# EAGLE design satellites_pcb_th_v1 (EAGLE 7.6.0)
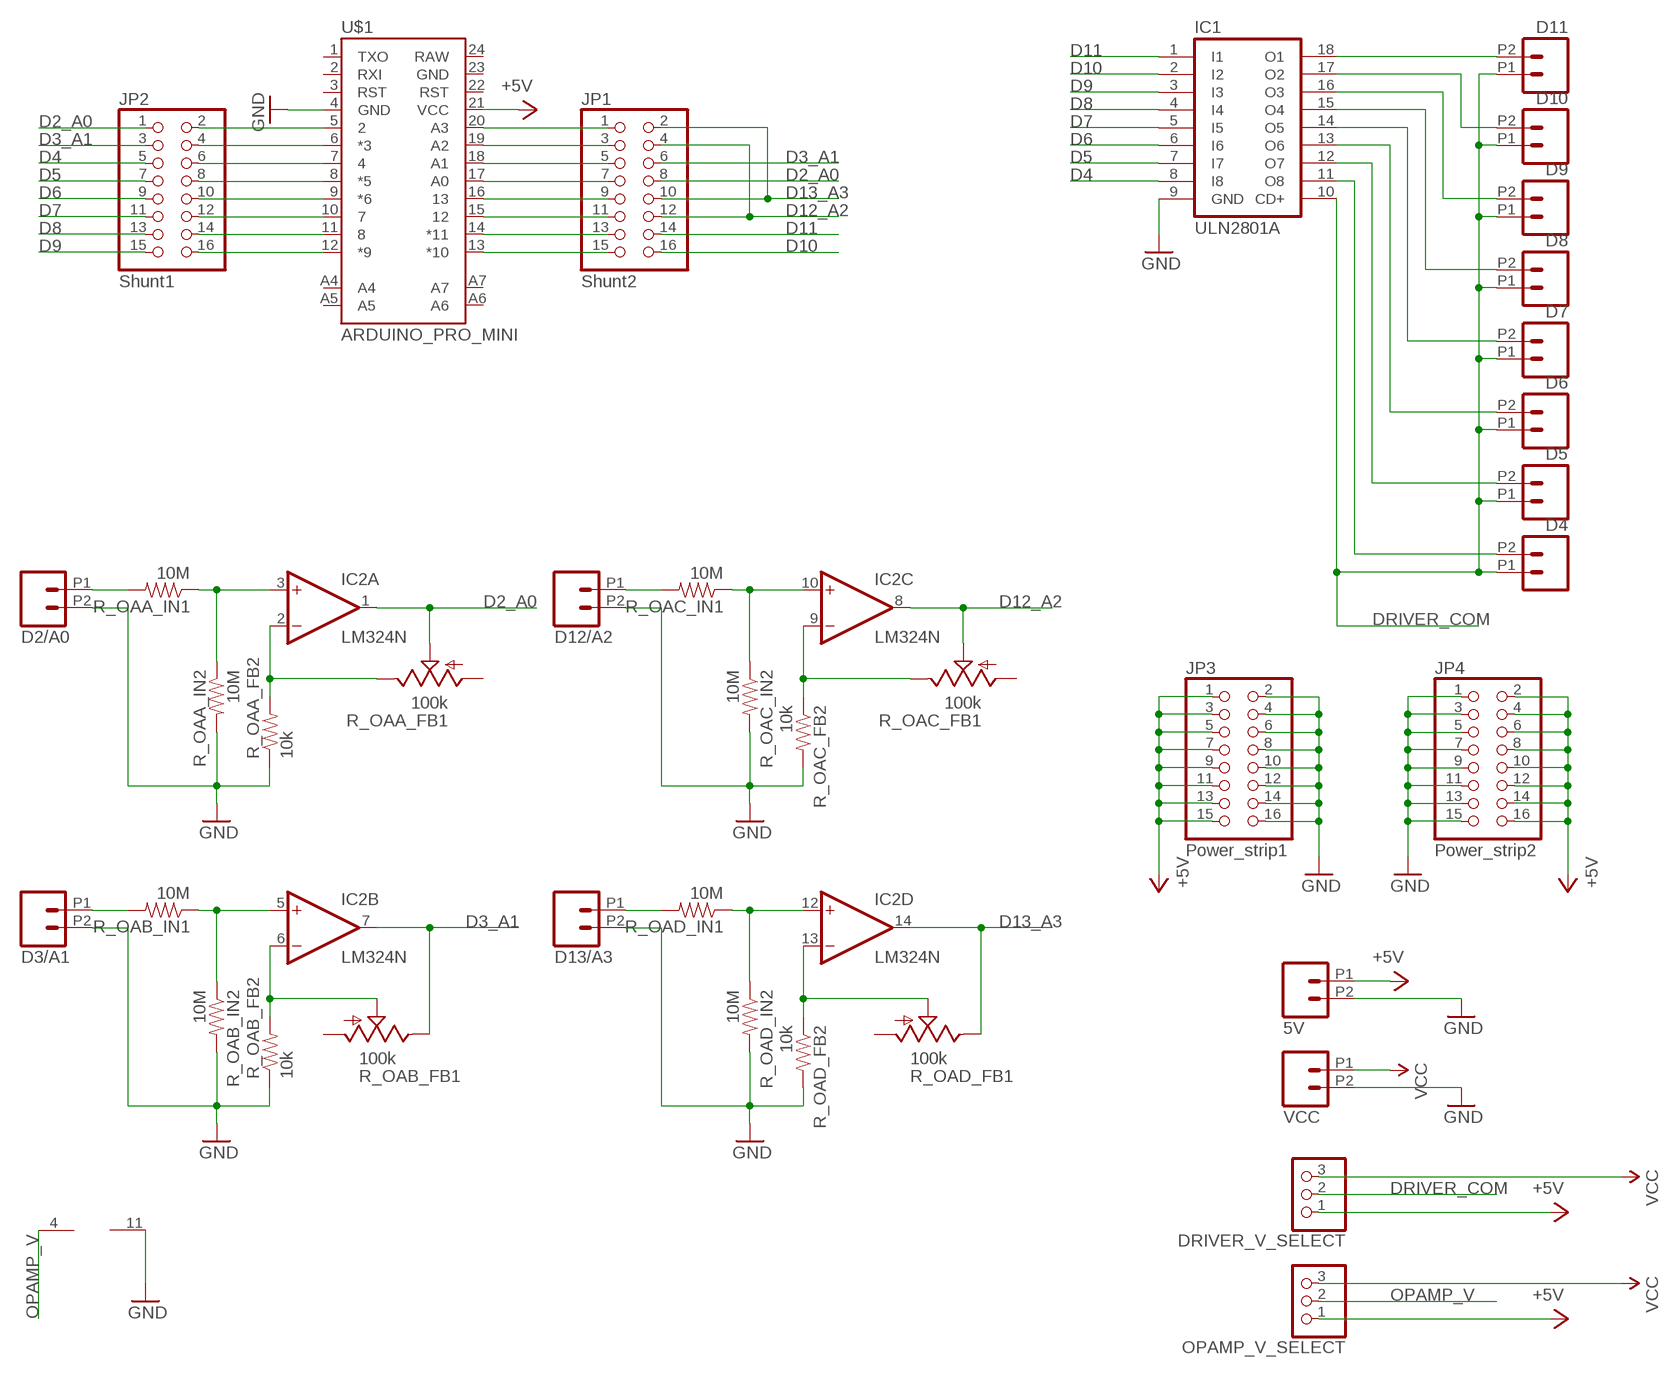
[diagram p0: schematic, sheet 1]

## Parts
5V  M022.54MM_SCREWTERM  [1X02_2.54_SCREWTERM]
D2/A0  M022.54MM_SCREWTERM  [1X02_2.54_SCREWTERM]
D3/A1  M022.54MM_SCREWTERM  [1X02_2.54_SCREWTERM]
D4  M022.54MM_SCREWTERM  [1X02_2.54_SCREWTERM]
D5  M022.54MM_SCREWTERM  [1X02_2.54_SCREWTERM]
D6  M022.54MM_SCREWTERM  [1X02_2.54_SCREWTERM]
D7  M022.54MM_SCREWTERM  [1X02_2.54_SCREWTERM]
D8  M022.54MM_SCREWTERM  [1X02_2.54_SCREWTERM]
D9  M022.54MM_SCREWTERM  [1X02_2.54_SCREWTERM]
D10  M022.54MM_SCREWTERM  [1X02_2.54_SCREWTERM]
D11  M022.54MM_SCREWTERM  [1X02_2.54_SCREWTERM]
D12/A2  M022.54MM_SCREWTERM  [1X02_2.54_SCREWTERM]
D13/A3  M022.54MM_SCREWTERM  [1X02_2.54_SCREWTERM]
DRIVER_V_SELECT  PINHD-1X3  [1X03]
IC1  ULN2801A  [DIL18]
IC2  LM324N  [DIL14]
JP1  Shunt2  PINHD-2X8  [2X08]
JP2  Shunt1  PINHD-2X8  [2X08]
JP3  Power_strip1  PINHD-2X8  [2X08]
JP4  Power_strip2  PINHD-2X8  [2X08]
OPAMP_V_SELECT  PINHD-1X3  [1X03]
R_OAA_FB1  100k  TRIM_US-B64W  [B64W]
R_OAA_FB2  10k  RESISTORAXIAL-0.3  [AXIAL-0.3]
R_OAA_IN1  10M  RESISTORAXIAL-0.3  [AXIAL-0.3]
R_OAA_IN2  10M  RESISTORAXIAL-0.3  [AXIAL-0.3]
R_OAB_FB1  100k  TRIM_US-B64W  [B64W]
R_OAB_FB2  10k  RESISTORAXIAL-0.3  [AXIAL-0.3]
R_OAB_IN1  10M  RESISTORAXIAL-0.3  [AXIAL-0.3]
R_OAB_IN2  10M  RESISTORAXIAL-0.3  [AXIAL-0.3]
R_OAC_FB1  100k  TRIM_US-B64W  [B64W]
R_OAC_FB2  10k  RESISTORAXIAL-0.3  [AXIAL-0.3]
R_OAC_IN1  10M  RESISTORAXIAL-0.3  [AXIAL-0.3]
R_OAC_IN2  10M  RESISTORAXIAL-0.3  [AXIAL-0.3]
R_OAD_FB1  100k  TRIM_US-B64W  [B64W]
R_OAD_FB2  10k  RESISTORAXIAL-0.3  [AXIAL-0.3]
R_OAD_IN1  10M  RESISTORAXIAL-0.3  [AXIAL-0.3]
R_OAD_IN2  10M  RESISTORAXIAL-0.3  [AXIAL-0.3]
U$1  ARDUINO_PRO_MINI  [ARDUINO_PRO_MINI]
VCC  M022.54MM_SCREWTERM  [1X02_2.54_SCREWTERM]

## Nets
+5V [supply]: 5V.P1 DRIVER_V_SELECT.1 JP3.1 JP3.3 JP3.5 JP3.7 JP3.9 JP3.11 JP3.13 JP3.15 JP4.2 JP4.4 JP4.6 JP4.8 JP4.10 JP4.12 JP4.14 JP4.16 OPAMP_V_SELECT.1 U$1.21(VCC)
D2_A0: IC2.1(A:OUT) JP1.8 JP2.1 R_OAA_FB1.S
D3_A1: IC2.7(B:OUT) JP1.6 JP2.3 R_OAB_FB1.E
D4: IC1.8(I8) JP2.5
D5: IC1.7(I7) JP2.7
D6: IC1.6(I6) JP2.9
D7: IC1.5(I5) JP2.11
D8: IC1.4(I4) JP2.13
D9: IC1.3(I3) JP2.15
D10: IC1.2(I2) JP1.16
D11: IC1.1(I1) JP1.14
D12_A2: IC2.8(C:OUT) JP1.4 JP1.12 R_OAC_FB1.S
D13_A3: IC2.14(D:OUT) JP1.2 JP1.10 R_OAD_FB1.E
DRIVER_COM [supply]: D4.P1 D5.P1 D6.P1 D7.P1 D8.P1 D9.P1 D10.P1 D11.P1 DRIVER_V_SELECT.2 IC1.10(CD+)
GND [supply]: 5V.P2 D2/A0.P2 D3/A1.P2 D12/A2.P2 D13/A3.P2 IC1.9(GND) IC2.11(P:V-) JP3.2 JP3.4 JP3.6 JP3.8 JP3.10 JP3.12 JP3.14 JP3.16 JP4.1 JP4.3 JP4.5 JP4.7 JP4.9 JP4.11 JP4.13 JP4.15 R_OAA_FB2.P$1 R_OAA_IN2.P$2 R_OAB_FB2.P$1 R_OAB_IN2.P$2 R_OAC_FB2.P$2 R_OAC_IN2.P$2 R_OAD_FB2.P$2 R_OAD_IN2.P$2 U$1.4(GND) VCC.P2
N$1: JP2.2 U$1.5
N$2: JP2.4 U$1.6(*3)
N$3: JP2.6 U$1.7
N$4: JP2.8 U$1.8(*5)
N$5: JP2.10 U$1.9(*6)
N$6: JP2.12 U$1.10
N$7: JP2.14 U$1.11
N$8: JP2.16 U$1.12(*9)
N$9: D3/A1.P1 R_OAB_IN1.P$2
N$10: JP1.1 U$1.20(A3)
N$11: JP1.3 U$1.19(A2)
N$12: JP1.5 U$1.18(A1)
N$13: IC2.3(A:+IN) R_OAA_IN1.P$1 R_OAA_IN2.P$1
N$14: D12/A2.P1 R_OAC_IN1.P$2
N$15: IC2.10(C:+IN) R_OAC_IN1.P$1 R_OAC_IN2.P$1
N$16: D13/A3.P1 R_OAD_IN1.P$2
N$17: JP1.7 U$1.17(A0)
N$18: JP1.9 U$1.16
N$19: JP1.11 U$1.15
N$20: JP1.13 U$1.14(*11)
N$21: JP1.15 U$1.13(*10)
N$22 [supply]: D4.P2 IC1.11(O8)
N$25 [supply]: D11.P2 IC1.18(O1)
N$26 [supply]: D10.P2 IC1.17(O2)
N$27 [supply]: D9.P2 IC1.16(O3)
N$28 [supply]: D8.P2 IC1.15(O4)
N$29 [supply]: D7.P2 IC1.14(O5)
N$30 [supply]: D6.P2 IC1.13(O6)
N$31 [supply]: D5.P2 IC1.12(O7)
N$36: IC2.2(A:-IN) R_OAA_FB1.E R_OAA_FB2.P$2
N$38: IC2.6(B:-IN) R_OAB_FB1.S R_OAB_FB2.P$2
N$40: IC2.9(C:-IN) R_OAC_FB1.E R_OAC_FB2.P$1
N$42: IC2.13(D:-IN) R_OAD_FB1.S R_OAD_FB2.P$1
N$44: D2/A0.P1 R_OAA_IN1.P$2
N$45: IC2.5(B:+IN) R_OAB_IN1.P$1 R_OAB_IN2.P$1
N$49: IC2.12(D:+IN) R_OAD_IN1.P$1 R_OAD_IN2.P$1
OPAMP_V [supply]: IC2.4(P:V+) OPAMP_V_SELECT.2
VCC [supply]: DRIVER_V_SELECT.3 OPAMP_V_SELECT.3 VCC.P1
Unconnected: R_OAA_FB1.A R_OAB_FB1.A R_OAC_FB1.A R_OAD_FB1.A U$1.1(TXO) U$1.2(RXI) U$1.3(RST) U$1.22(RST) U$1.23(GND) U$1.24(RAW) U$1.A4 U$1.A5 U$1.A6 U$1.A7

## Library data of the parts
5V D2/A0 D3/A1 D4-D11 D12/A2 D13/A3 VCC = SparkFun-Connectors:M02: Standard 2-pin 0.1" header. Use with - straight break away headers ( PRT-00116) - right angle break away headers (PRT-00553) - swiss pins (PRT-00743) - machine pins (PRT-00117) - female headers (PRT-00115) Molex polarized connector foot print use with: PRT-08233 with associated crimp pins and housings. 2.54_SCREWTERM for use with PRT-10571. 3.5mm Screw Terminal footprints for PRT-08084 5mm Screw Terminal footprints for use with PRT-08432
DRIVER_V_SELECT OPAMP_V_SELECT = pinhead:PINHD-1X3: PIN HEADER
IC1 = uln-udn:ULN2801A: DRIVER ARRAY
IC2 = linear:LM324: OP AMP
JP1-JP4 = pinhead:PINHD-2X8: PIN HEADER
R_OAA_FB1 R_OAB_FB1 R_OAC_FB1 R_OAD_FB1 = pot:TRIM_US-: POTENTIOMETER
R_OAA_FB2 R_OAA_IN1 R_OAA_IN2 R_OAB_FB2 R_OAB_IN1 R_OAB_IN2 R_OAC_FB2 R_OAC_IN1 R_OAC_IN2 R_OAD_FB2 R_OAD_IN1 R_OAD_IN2 = SparkFun-Resistors:RESISTOR: Resistor Basic schematic elements and footprints for 0603, 1206, and PTH resistors.
U$1 = SparkFun-Boards:ARDUINO_PRO_MINI

## Net classes
0 default: width 0.254 mm, clearance 0.254 mm
1 supply: width 0.508 mm, clearance 0.508 mm

## Board
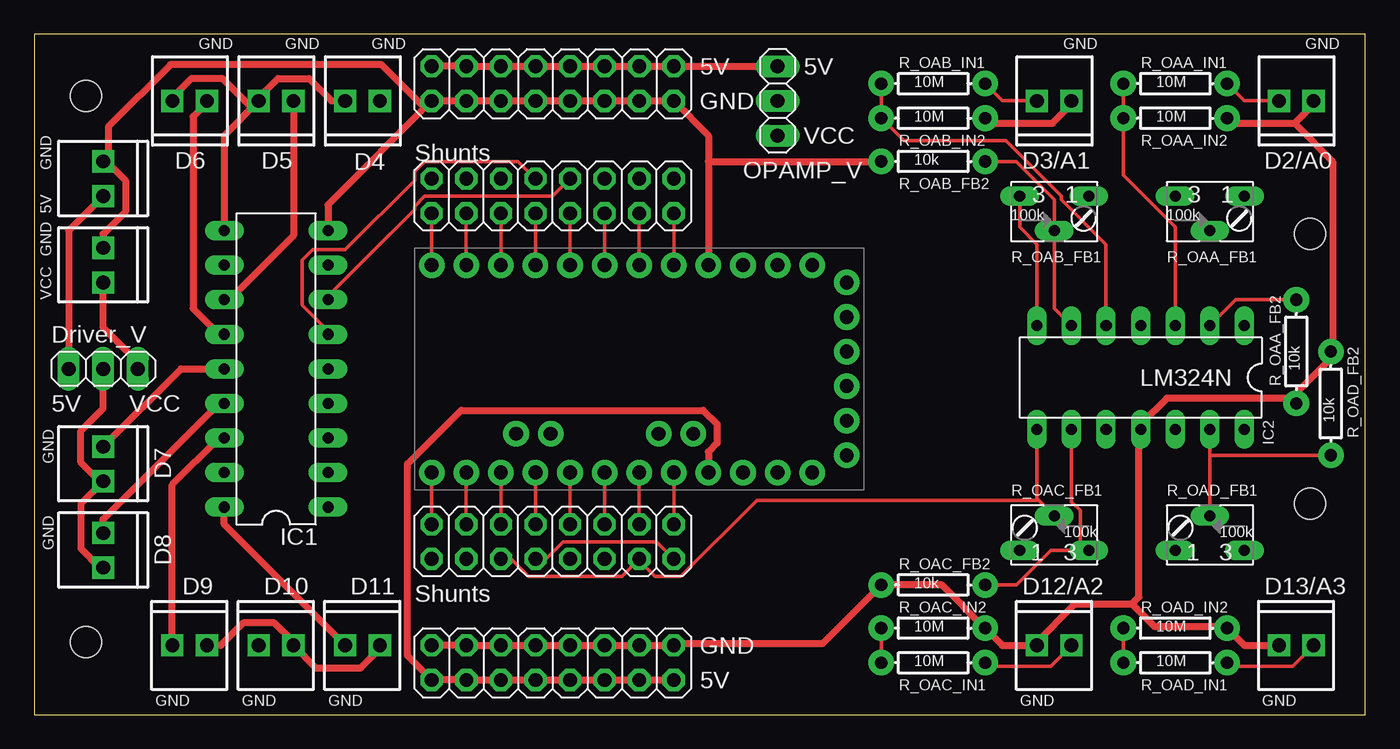
[diagram p1: board, top side]
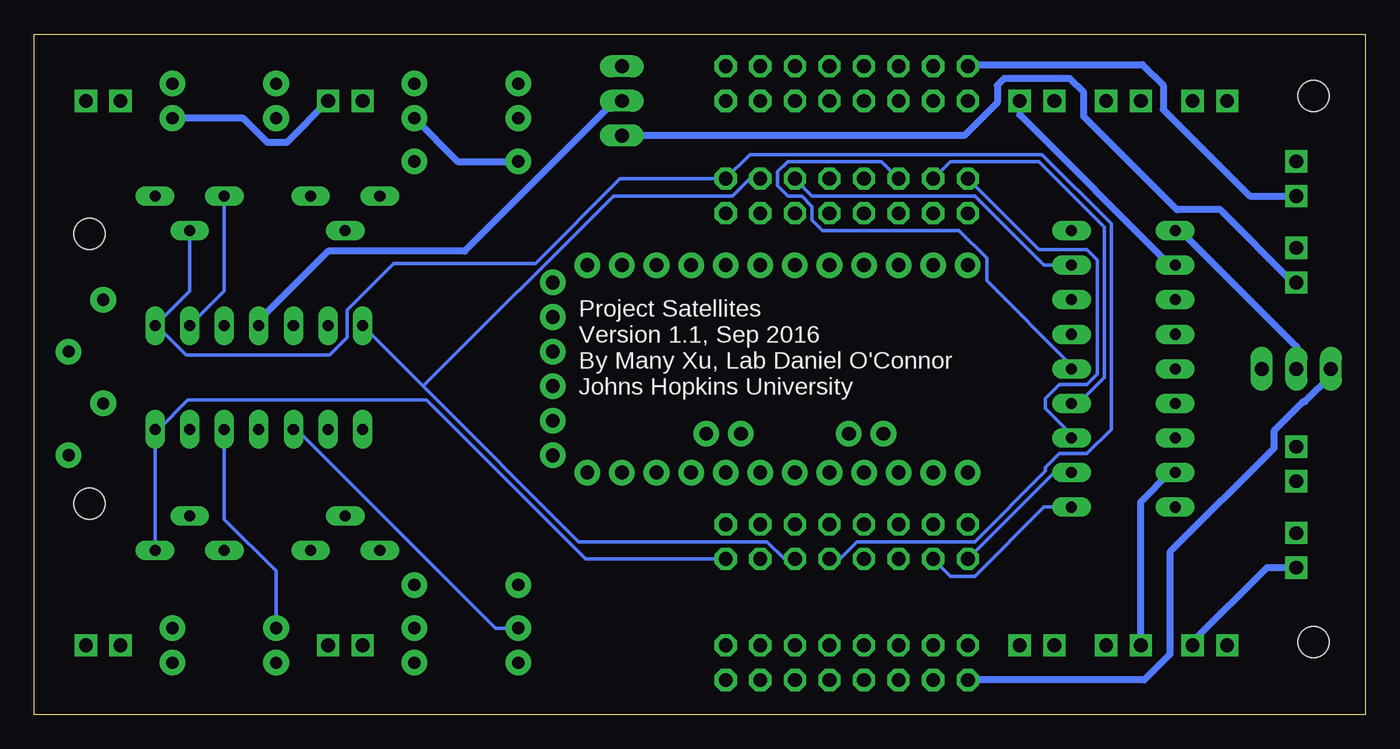
[diagram p2: board, bottom side, seen from below]

Size 97.79 x 50 mm. Coordinates in mm from the lower left corner, seen from the top.
Outline: 0,0 97.79,0 97.79,50 0,50 0,0
Copper layers (1*16): Top 0.035mm / dielectric 1.5mm / Bottom 0.035mm
Design rules "SparkFun": minimum track width 8mil, minimum drill 20mil, track to track 8mil, track to pad 8mil, pad to pad 8mil, via to via 8mil, smd to smd 8mil, copper to edge 10mil, drill to drill 8mil, minimum pad ring 12mil, minimum via ring 10mil, stop-mask expansion 4mil, vias tented up to drill 25mil, thermal gap 10mil
Holes 2.29 mm at 93.73,15.49 93.73,35.31 3.81,45.47 3.81,5.33

### Footprints (pad centres in the part's own frame; a part is rotated, then mirrored left to right if it is on the bottom)
1X02_2.54_SCREWTERM = drill 1.016 square: P1 2.54,0; P2 0,0
1X03 = drill 1.016 long: 1 -2.54,0; 2 0,0; 3 2.54,0
DIL18 = drill 0.813 long: 1 -10.16,-3.81; 2 -7.62,-3.81; 3 -5.08,-3.81; 4 -2.54,-3.81; 5 0,-3.81; 6 2.54,-3.81; 7 5.08,-3.81; 8 7.62,-3.81; 9 10.16,-3.81; 10 10.16,3.81; 11 7.62,3.81; 12 5.08,3.81; 13 2.54,3.81; 14 0,3.81; 15 -2.54,3.81; 16 -5.08,3.81; 17 -7.62,3.81; 18 -10.16,3.81
DIL14 = drill 0.813 long: 1 -7.62,-3.81; 2 -5.08,-3.81; 3 -2.54,-3.81; 4 0,-3.81; 5 2.54,-3.81; 6 5.08,-3.81; 7 7.62,-3.81; 8 7.62,3.81; 9 5.08,3.81; 10 2.54,3.81; 11 0,3.81; 12 -2.54,3.81; 13 -5.08,3.81; 14 -7.62,3.81
2X08 = drill 1.016 octagon: 1 -8.89,-1.27; 2 -8.89,1.27; 3 -6.35,-1.27; 4 -6.35,1.27; 5 -3.81,-1.27; 6 -3.81,1.27; 7 -1.27,-1.27; 8 -1.27,1.27; 9 1.27,-1.27; 10 1.27,1.27; 11 3.81,-1.27; 12 3.81,1.27; 13 6.35,-1.27; 14 6.35,1.27; 15 8.89,-1.27; 16 8.89,1.27
B64W = drill 0.813 long: A 2.54,0; E -2.54,0; S 0,-2.54
AXIAL-0.3 = drill 0.9 pad 1.88: P$1 -3.81,0; P$2 3.81,0
ARDUINO_PRO_MINI = drill 1.016 pad 1.88: 1 -7.62,12.7; 2 -7.62,10.16; 3 -7.62,7.62; 4 -7.62,5.08; 5 -7.62,2.54; 6 -7.62,0; 7 -7.62,-2.54; 8 -7.62,-5.08; 9 -7.62,-7.62; 10 -7.62,-10.16; 11 -7.62,-12.7; 12 -7.62,-15.24; 13 7.62,-15.24; 14 7.62,-12.7; 15 7.62,-10.16; 16 7.62,-7.62; 17 7.62,-5.08; 18 7.62,-2.54; 19 7.62,0; 20 7.62,2.54; 21 7.62,5.08; 22 7.62,7.62; 23 7.62,10.16; 24 7.62,12.7; A4 4.763,1.429; A5 4.763,3.969; A6 4.763,-9.049; A7 4.763,-6.509; BLK -6.35,15.24; GND -3.81,15.24; GRN 6.35,15.24; RXI 1.27,15.24; TXO 3.81,15.24; VCC -1.27,15.24

### Placement (x,y rotation side)
5V  5.08,40.64 270 top
D2/A0  93.98,45.09 180 top
D3/A1  76.2,45.09 180 top
D4  25.4,45.09 180 top
D5  19.05,45.09 180 top
D6  12.7,45.09 180 top
D7  5.08,19.68 270 top
D8  5.08,13.34 270 top
D9  10.16,5.08 0 top
D10  16.51,5.08 0 top
D11  22.86,5.08 0 top
D12/A2  73.66,5.08 0 top
D13/A3  91.44,5.08 0 top
DRIVER_V_SELECT  5.08,25.4 0 top
IC1  17.78,25.4 90 top
IC2  81.28,24.77 180 top
JP1  38.1,12.7 180 top
JP2  38.1,38.1 180 top
JP3  38.1,3.81 0 top
JP4  38.1,46.35 0 top
OPAMP_V_SELECT  54.61,45.09 270 top
R_OAA_FB1  86.36,38.1 0 top
R_OAA_FB2  92.71,26.67 90 top
R_OAA_IN1  83.82,46.35 0 top
R_OAA_IN2  83.82,43.81 0 top
R_OAB_FB1  74.93,38.1 0 top
R_OAB_FB2  66.04,40.64 0 top
R_OAB_IN1  66.04,46.35 0 top
R_OAB_IN2  66.04,43.81 0 top
R_OAC_FB1  74.93,12.06 180 top
R_OAC_FB2  66.04,9.53 180 top
R_OAC_IN1  66.04,3.81 0 top
R_OAC_IN2  66.04,6.35 0 top
R_OAD_FB1  86.36,12.06 180 top
R_OAD_FB2  95.25,22.86 90 top
R_OAD_IN1  83.82,3.81 0 top
R_OAD_IN2  83.82,6.35 0 top
U$1  44.45,25.4 270 top
VCC  5.08,34.29 270 top

### Tracks (layer width: path | path; a pad name or v marks a point on that pad's centre or on a via)
+5V
  Top 0.508: JP3.15 JP3.13 JP3.11 JP3.9 JP3.7 JP3.5 JP3.3 JP3.1 27.43,4.32 27.43,18.41 31.37,22.35 49.15,22.35 50.16,21.34 50.16,19.94 49.53,19.3 U$1.21 | DRIVER_V_SELECT.1 2.54,35.56 5V.P1 | JP4.2 JP4.4 JP4.6 JP4.8 JP4.10 JP4.12 JP4.14 JP4.16 OPAMP_V_SELECT.1
  Bottom 0.508: 5V.P1 8.51,38.1 14.86,44.45 14.86,46.23 16.38,47.75 29.08,47.75 JP4.2 | JP3.1 16.26,2.54 14.35,4.45 14.35,11.94 6.73,19.56 6.73,20.83 4.57,22.99 4.45,22.99 2.54,24.89 DRIVER_V_SELECT.1
D2_A0
  Bottom 0.254: R_OAA_FB1.S 86.36,31.11 IC2.1 88.77,28.57 86.61,26.42 76.07,26.42 74.8,27.69 74.8,29.72 71.37,33.15 60.96,33.15 54.74,39.37 JP2.1 45.21,41.15 23.75,41.15 18.67,36.07 18.67,20.95 20.45,19.18 22.48,19.18 23.5,18.16 23.5,17.91 28.7,12.7 37.34,12.7 38.61,11.43 JP1.8
D3_A1
  Top 0.254: IC2.7 73.66,34.54 72.39,35.81 R_OAB_FB1.E
  Bottom 0.254: JP1.6 42.67,11.43 43.94,12.7 57.78,12.7 69.22,24.13 | IC2.7 69.22,24.13 | JP2.3 45.21,39.37 46.48,38.1 55.24,38.1 69.22,24.13
D4
  Bottom 0.254: IC1.8 23.62,33.02 28.7,38.1 40.64,38.1 JP2.5
D5
  Top 0.254: IC1.7 21.59,30.73 27.94,37.08 27.94,37.34 28.7,38.1 38.1,38.1 JP2.7
D6
  Top 0.254: IC1.6 21.59,28.19 19.68,30.1 19.68,33.4 20.45,34.16 22.86,34.16 27.94,39.24 27.94,39.88 28.7,40.64 35.56,40.64 JP2.9
D7
  Bottom 0.254: IC1.5 21.59,25.65 27.81,31.88 27.81,33.53 29.84,35.56 39.88,35.56 40.64,36.32 40.64,37.34 41.4,38.1 42.42,38.1 43.18,38.86 43.18,39.88 42.42,40.64 35.56,40.64 JP2.11
D8
  Bottom 0.254: IC1.4 21.08,22.86 19.18,24.77 19.18,35.81 24,40.64 30.48,40.64 JP2.13
D9
  Bottom 0.254: IC1.3 21.59,20.57 23.5,22.48 23.5,23.24 22.48,24.26 20.45,24.26 19.68,25.02 19.68,33.4 20.45,34.16 24,34.16 JP2.15
D10
  Bottom 0.254: IC1.2 22.86,17.78 JP1.16
D11
  Bottom 0.254: IC1.1 23.62,15.24 28.7,10.16 30.48,10.16 JP1.14
D12_A2
  Top 0.254: IC2.8 73.66,15.88 73.72,15.81 | R_OAC_FB1.S 73.72,15.81 | JP1.12 35.05,11.43 36.32,10.16 43.18,10.16 JP1.4 44.45,11.3 45.59,10.16 47.5,10.16 53.09,15.75 73.66,15.75 73.72,15.81
D13_A3
  Top 0.254: JP1.10 37.59,11.43 38.86,12.7 45.72,12.7 JP1.2
  Bottom 0.254: R_OAD_FB1.E IC2.14 88.65,20.95 86.49,23.11 68.96,23.11 57.28,11.43 JP1.2
DRIVER_COM
  Top 0.508: IC1.10 13.97,42.55 D5.P1 | D6.P1 10.16,45.34 11.56,46.74 13.84,46.74 15.88,44.7 D5.P1 | D4.P1 21.84,45.09 20.19,46.74 17.91,46.74 16.51,45.34 D5.P1 | D9.P1 13.72,5.08 15.37,6.73 17.65,6.73 19.05,5.33 D10.P1 20.7,3.43 24,3.43 25.4,4.83 D11.P1 | D8.P1 4.83,10.79 3.43,12.19 3.43,15.49 D7.P1 4.83,17.14 3.43,18.54 3.43,20.83 5.08,22.48 DRIVER_V_SELECT.2
  Bottom 0.508: D9.P1 12.7,5.33 7.24,10.79 D8.P1 | IC1.10 13.59,35.56 5.08,27.05 DRIVER_V_SELECT.2
GND
  Top 0.508: JP3.2 JP3.4 JP3.6 JP3.8 JP3.10 JP3.12 JP3.14 JP3.16 47.12,5.21 57.91,5.21 R_OAC_FB2.P$2 66.67,9.53 R_OAC_IN2.P$2 71.12,5.08 D12/A2.P2 73.53,5.21 76.45,8.13 80.64,8.13 | D13/A3.P2 88.9,5.08 R_OAD_IN2.P$2 87.5,6.48 82.3,6.48 80.64,8.13 | 80.64,8.13 81.15,8.64 81.15,20.83 IC2.11 81.28,21.34 83.19,23.24 92.33,23.24 R_OAA_FB2.P$1 92.46,23.37 95.25,26.16 R_OAD_FB2.P$2 95.38,26.8 95.38,40.64 92.58,43.43 | D2/A0.P2 93.98,44.83 92.58,43.43 | 92.58,43.43 88.01,43.43 R_OAA_IN2.P$2 | D3/A1.P2 76.2,44.83 74.8,43.43 70.23,43.43 R_OAB_IN2.P$2 | VCC.P2 5.08,35.31 6.73,36.96 6.73,39.24 5.33,40.64 5V.P2 5.46,40.77 5.46,43.18 10.03,47.75 25.53,47.75 28.57,44.7 JP4.1 | IC1.9 21.59,37.47 JP4.1 | JP4.1 JP4.3 JP4.5 JP4.7 JP4.9 JP4.11 JP4.13 JP4.15 49.53,42.55 49.53,40.64 | 49.53,40.64 U$1.4 | 49.53,40.64 R_OAB_FB2.P$1
  Bottom 0.508: R_OAB_FB2.P$1 66.67,40.64 R_OAB_IN2.P$2 | R_OAA_IN2.P$2 82.42,43.81 80.64,42.04 79.25,42.04 D3/A1.P2
N$1
  Top 0.254: U$1.5 JP2.2
N$2
  Top 0.254: U$1.6 JP2.4
N$3
  Top 0.254: U$1.7 JP2.6
N$4
  Top 0.254: U$1.8 JP2.8
N$5
  Top 0.254: U$1.9 JP2.10
N$6
  Top 0.254: U$1.10 JP2.12
N$7
  Top 0.254: U$1.11 JP2.14
N$8
  Top 0.254: U$1.12 JP2.16
N$9
  Top 0.254: D3/A1.P1 71.12,45.09 R_OAB_IN1.P$2
N$10
  Top 0.254: U$1.20 JP1.1
N$11
  Top 0.254: U$1.19 JP1.3
N$12
  Top 0.254: U$1.18 JP1.5
N$13
  Top 0.254: IC2.3 83.82,35.81 80.01,39.62 R_OAA_IN2.P$1 R_OAA_IN1.P$1
N$14
  Top 0.254: D12/A2.P1 74.68,3.56 70.1,3.56 R_OAC_IN1.P$2
N$15
  Top 0.254: R_OAC_IN2.P$1 R_OAC_IN1.P$1
  Bottom 0.254: IC2.10 78.49,20.95 63.88,6.35 R_OAC_IN2.P$1
N$16
  Top 0.254: D13/A3.P1 92.46,3.56 87.88,3.56 R_OAD_IN1.P$2
N$17
  Top 0.254: U$1.17 JP1.7
N$18
  Top 0.254: U$1.16 JP1.9
N$19
  Top 0.254: U$1.15 JP1.11
N$20
  Top 0.254: U$1.14 JP1.13
N$21
  Top 0.254: U$1.13 JP1.15
N$22
  Bottom 0.508: IC1.11 14.35,33.02 25.4,44.07 D4.P2
N$25
  Top 0.508: IC1.18 13.97,13.97 D11.P2
N$26
  Bottom 0.508: IC1.17 14.35,17.78 16.51,15.62 D10.P2
N$27
  Top 0.508: IC1.16 13.59,20.32 10.16,16.89 D9.P2
N$28
  Top 0.508: IC1.15 13.59,22.86 5.08,14.35 D8.P2
N$29
  Top 0.508: IC1.14 10.79,25.4 D7.P2
N$30
  Top 0.508: IC1.13 13.59,27.94 11.68,29.84 11.68,43.94 12.7,44.96 D6.P2
N$31
  Top 0.508: IC1.12 14.35,30.48 19.05,35.18 D5.P2
N$36
  Top 0.254: R_OAA_FB2.P$2 88.27,30.48 IC2.2
  Bottom 0.254: R_OAA_FB1.E 83.82,31.11 IC2.2
N$38
  Top 0.254: IC2.6 74.93,29.84 R_OAB_FB1.S 74.93,37.85 72.14,40.64 R_OAB_FB2.P$2
N$40
  Top 0.254: 76.83,12.06 74.68,12.06 72.14,9.53 R_OAC_FB2.P$1 | IC2.9 76.2,15.62 76.83,14.99 76.83,12.06 | 76.83,12.06 R_OAC_FB1.E
N$42
  Top 0.254: IC2.13 86.36,19.05 | 86.36,19.05 R_OAD_FB1.S | 86.36,19.05 R_OAD_FB2.P$1
N$44
  Top 0.254: D2/A0.P1 88.9,45.09 R_OAA_IN1.P$2
N$45
  Top 0.254: IC2.5 78.74,34.54 75.44,37.85 75.44,38.1 71.37,42.16 63.88,42.16 R_OAB_IN2.P$1 R_OAB_IN1.P$1
N$49
  Top 0.254: R_OAD_IN2.P$1 R_OAD_IN1.P$1
  Bottom 0.254: IC2.12 83.82,14.35 80.01,10.54 R_OAD_IN2.P$1
OPAMP_V
  Bottom 0.508: IC2.4 81.28,28.96 76.2,34.04 66.17,34.04 55.12,45.09 OPAMP_V_SELECT.2
VCC
  Top 0.508: VCC.P1 5.08,28.45 7.62,25.91 DRIVER_V_SELECT.3
  Bottom 0.508: OPAMP_V_SELECT.3 29.46,42.55 27.05,44.96 27.05,46.23 26.54,46.74 21.72,46.74 20.7,45.72 20.7,43.94 13.84,37.08 10.67,37.08 5.33,31.75 VCC.P1

### Text on the board
tPlace: GND | GND | GND | GND | GND | 5V | 5V | GND | VCC | Shunts | GND | D4 | OPAMP_V | 5V | GND | VCC | Driver_V | 5V | VCC | GND | GND | Shunts | GND | 5V | GND | GND | GND | GND | GND
bPlace: Project Satellites / Version 1.1, Sep 2016 / By Many Xu, Lab Daniel O'Connor / Johns Hopkins University